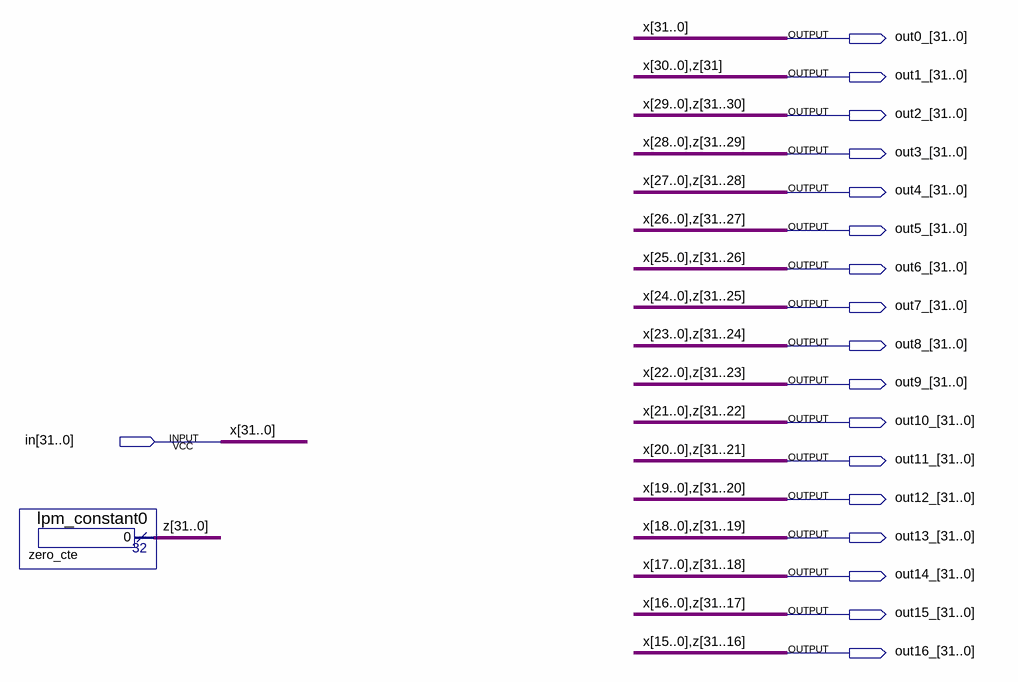
[diagram p0: schematic sheet]
// Quartus schematic l_extender16.bdf as structural Verilog: 1 symbols, 18 pins
module l_extender16 (
  input  [31:0] in,
  output [31:0] out0_,
  output [31:0] out1_,
  output [31:0] out2_,
  output [31:0] out3_,
  output [31:0] out4_,
  output [31:0] out5_,
  output [31:0] out6_,
  output [31:0] out7_,
  output [31:0] out8_,
  output [31:0] out9_,
  output [31:0] out10_,
  output [31:0] out11_,
  output [31:0] out12_,
  output [31:0] out13_,
  output [31:0] out14_,
  output [31:0] out15_,
  output [31:0] out16_
);

  wire [15:0] z;

  lpm_constant0 zero_cte (.result({out1_[0], out2_[0], out3_[0], out4_[0], out5_[0], out6_[0], out7_[0], out8_[0], out9_[0], out10_[0], out11_[0], out12_[0], out13_[0], out14_[0], out15_[0], out16_[0], z}));

  assign out0_ = in;
  assign out1_[31:1] = in[30:0];
  assign out2_[31:1] = {in[29:0], out1_[0]};
  assign out3_[31:1] = {in[28:0], out1_[0], out2_[0]};
  assign out4_[31:1] = {in[27:0], out1_[0], out2_[0], out3_[0]};
  assign out5_[31:1] = {in[26:0], out1_[0], out2_[0], out3_[0], out4_[0]};
  assign out6_[31:1] = {in[25:0], out1_[0], out2_[0], out3_[0], out4_[0], out5_[0]};
  assign out7_[31:1] = {in[24:0], out1_[0], out2_[0], out3_[0], out4_[0], out5_[0], out6_[0]};
  assign out8_[31:1] = {in[23:0], out1_[0], out2_[0], out3_[0], out4_[0], out5_[0], out6_[0], out7_[0]};
  assign out9_[31:1] = {in[22:0], out1_[0], out2_[0], out3_[0], out4_[0], out5_[0], out6_[0], out7_[0], out8_[0]};
  assign out10_[31:1] = {in[21:0], out1_[0], out2_[0], out3_[0], out4_[0], out5_[0], out6_[0], out7_[0], out8_[0], out9_[0]};
  assign out11_[31:1] = {in[20:0], out1_[0], out2_[0], out3_[0], out4_[0], out5_[0], out6_[0], out7_[0], out8_[0], out9_[0], out10_[0]};
  assign out12_[31:1] = {in[19:0], out1_[0], out2_[0], out3_[0], out4_[0], out5_[0], out6_[0], out7_[0], out8_[0], out9_[0], out10_[0], out11_[0]};
  assign out13_[31:1] = {in[18:0], out1_[0], out2_[0], out3_[0], out4_[0], out5_[0], out6_[0], out7_[0], out8_[0], out9_[0], out10_[0], out11_[0], out12_[0]};
  assign out14_[31:1] = {in[17:0], out1_[0], out2_[0], out3_[0], out4_[0], out5_[0], out6_[0], out7_[0], out8_[0], out9_[0], out10_[0], out11_[0], out12_[0], out13_[0]};
  assign out15_[31:1] = {in[16:0], out1_[0], out2_[0], out3_[0], out4_[0], out5_[0], out6_[0], out7_[0], out8_[0], out9_[0], out10_[0], out11_[0], out12_[0], out13_[0], out14_[0]};
  assign out16_[31:1] = {in[15:0], out1_[0], out2_[0], out3_[0], out4_[0], out5_[0], out6_[0], out7_[0], out8_[0], out9_[0], out10_[0], out11_[0], out12_[0], out13_[0], out14_[0], out15_[0]};

  // Other names for the same wires on the sheet: x[31:0] = in;
  //   z[31:16] = {out1_[0], out2_[0], out3_[0], out4_[0], out5_[0], out6_[0], out7_[0], out8_[0], out9_[0], out10_[0], out11_[0], out12_[0], out13_[0], out14_[0], out15_[0], out16_[0]}
endmodule
